# Altium schematic sheet 11)KEY,LED.SchDoc
size 297 x 209 mm
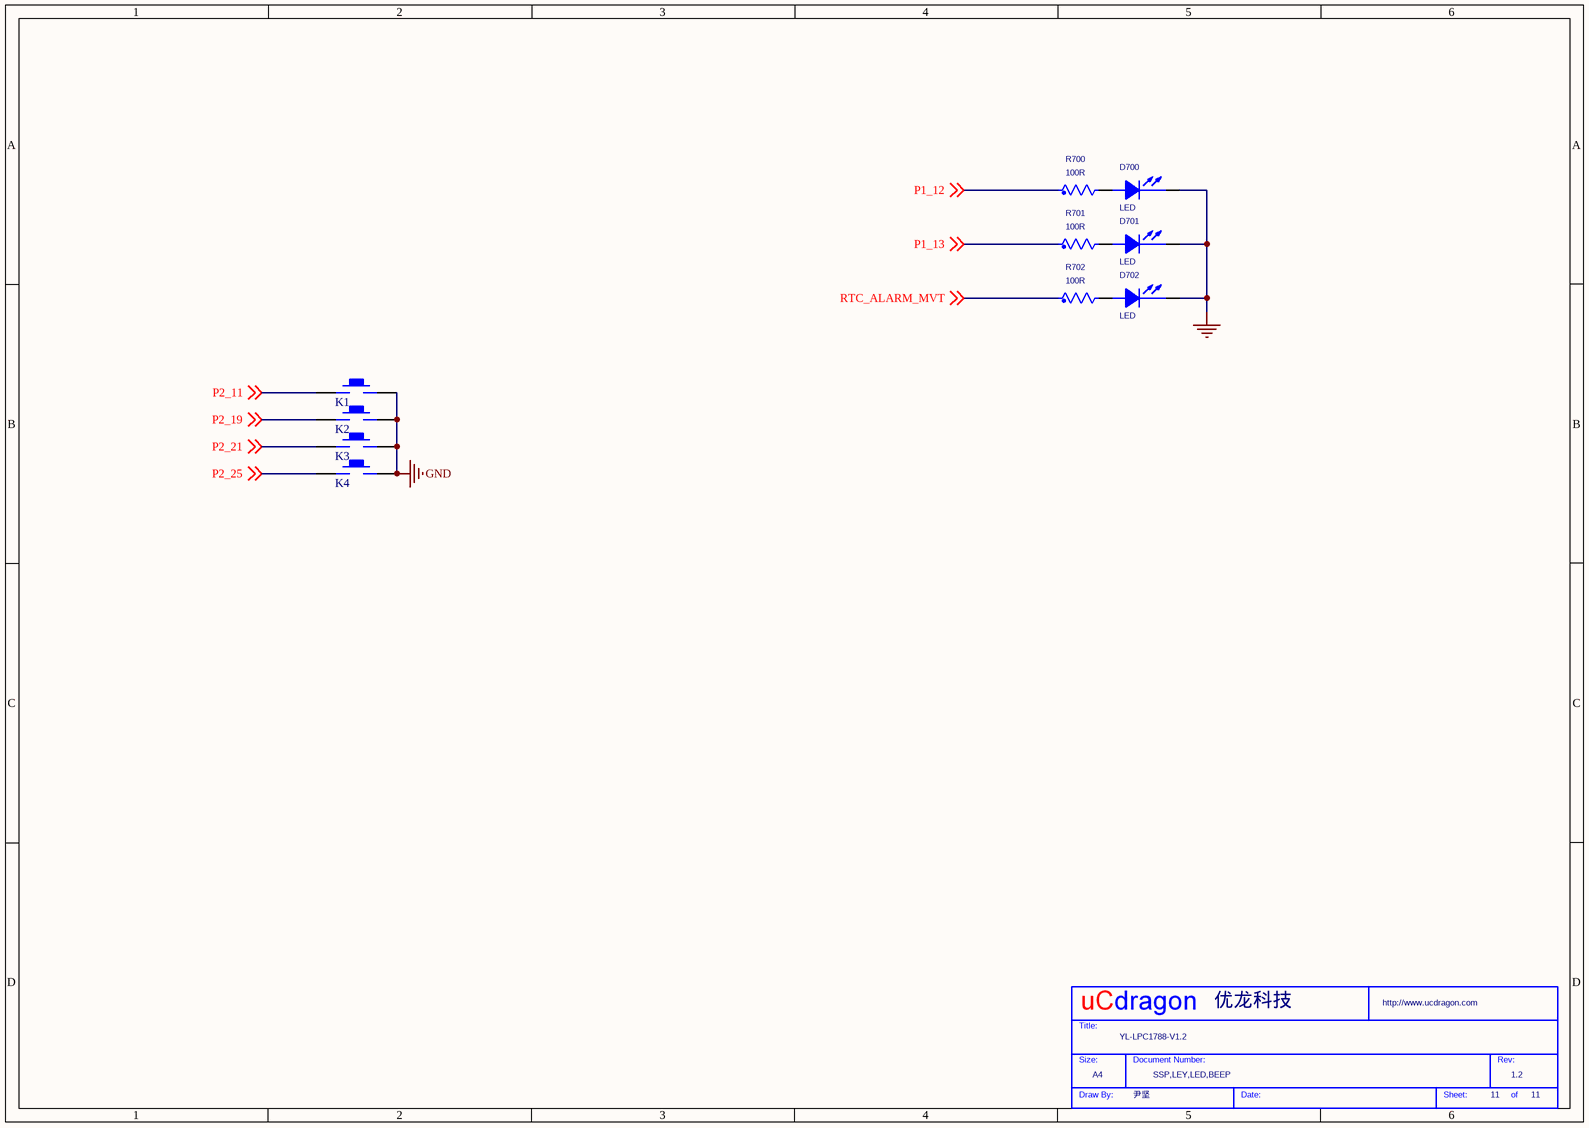
[diagram p0: 11)KEY,LED.SchDoc]

## Parts
*  Page Count: 11  Page Size: A4  Title: YL-LPC1788-V1.2  RevCode: 1.2  Doc: SSP,LEY,LED,BEEP  Drawing: 尹坚  Company: 优龙科技  (hidden comment: My Title 0)  (graphical)
D700  LED  [SMDLED]
D701  LED  [SMDLED]
D702  LED  [SMDLED]
K1  KEY_M  [K贴片]  (value not drawn)
K2  KEY_M  [K贴片]  (value not drawn)
K3  KEY_M  [K贴片]  (value not drawn)
K4  KEY_M  [K贴片]  (value not drawn)
R700  100R  [0603P]
R701  100R  [0603P]
R702  100R  [0603P]

## Nets
GND: K1.1 K2.1 K3.1 K4.1
GND_POWER: D700.2(CATHODE) D701.2(CATHODE) D702.2(CATHODE)
P1_12: R700.1 ; off-sheet P1_12
P1_13: R701.1 ; off-sheet P1_13
P2_11: K1.2 ; off-sheet P2_11
P2_19: K2.2 ; off-sheet P2_19
P2_21: K3.2 ; off-sheet P2_21
P2_25: K4.2 ; off-sheet P2_25
RTC_ALARM_MVT: R702.1 ; off-sheet RTC_ALARM_MVT
NetD700_1: D700.1(ANODE) R700.2
NetD701_1: D701.1(ANODE) R701.2
NetD702_1: D702.1(ANODE) R702.2

## Notes on the sheet
- (in symbol My Title 0) Title:; Size:; Document Number:; Rev:; Draw By:; Date:; Sheet:; of

## Library data of the parts
R700-R702 = R_Generic_Dup2
* = My Title 0: Page Number: 11; Page Create Date: May 29, 2006; WebSite: http://www.ucdragon.com